# Altium project ws22_companion-1_0_0.PrjPcb (part 4 of 4)

## Sheet switch_profet_btt62001.SchDoc
size A; SheetNumber: 15
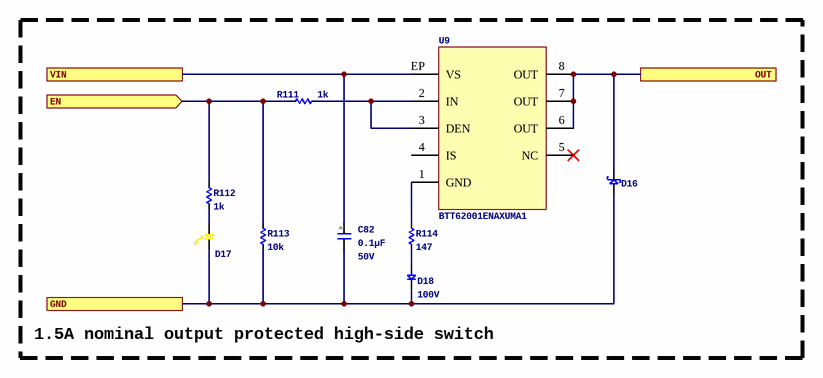
[diagram p17: switch_profet_btt62001.SchDoc]

### Parts
C82  Capacitance: 0.1µF  Voltage - Rated: 50V  [C0402_0.55MM]  (hidden comment: CGA2B3X7R1H104M050BB)
D16  15MQ040NPBF  [SMA]  (value not drawn)
D17  LTST-C190YKT  [LED_0603P_YELLOW]  (value not drawn)
D18  Voltage - DC Reverse (Vr) (Max): 100V  [SOD123]  (hidden comment: 1N4148W-TP)
R111  Resistance: 1k  [R0402_0.40MM]
R112  Resistance: 1k  [R0402_0.40MM]  (hidden comment: ERJ-2RKF1001X)
R113  Resistance: 10k  [R0402_0.40MM]
R114  Resistance: 147  [R0402_0.40MM]  (hidden comment: ERJ-2RKF1470X)
U9  BTT62001ENAXUMA1  [PG-TDSO-8-31]

### Blocks framed on the sheet
1.5A nominal output protected high-side switch: C82 D16-D18 R111-R114 U9

### Ports
EN (in), GND, OUT, VIN

### Nets
GND: C82.2 D16.1 D17.1 D18.2 R113.1 ; port GND
LV: C82.1 U9.EP(VS) ; port VIN
WS22_PWR: D16.2 U9.6(OUT) U9.7(OUT) U9.8(OUT) ; port OUT
WS22_PWREN: R111.2 R112.2 R113.2 ; port EN
NetD17_2: D17.2 R112.1
NetD18_1: D18.1 R114.1
NetR111_1: R111.1 U9.2(IN) U9.3(DEN)
NetR114_2: R114.2 U9.1(GND)

Not connected (* = marked no-connect by the designer): U9 4(IS) 5(NC)*

### Notes on the sheet
- (in symbol CGA2B3X7R1H104M050BB) A

### Library data of the parts
C82 = CGA2B3X7R1H104M050BB: as C48 on sheet eth_lan8742a_phy; ComponentLink1URL: https://product.tdk.com/info/en/catalog/datasheets/mlcc_automotive_general_en.pdf?ref_disty=digikey; ComponentLink1Description: Series Datasheet; Series: CGA; Part Status: Active; Temperature Coefficient: X7R; Operating Temperature: -55°C ~ 125°C; Applications: AEC-Q200; Mounting Type: Surface Mount, MLCC; Package / Case: 0402 (1005 Metric); Size / Dimension: 0.039" L x 0.020" W (1.00mm x 0.50mm); Thickness (Max): 0.022" (0.55mm); Supplier 1: Digikey; Supplier Part Number 1: 445-12271-1-ND; Manufacturer Part Number: CGA2B3X7R1H104M050BB
D16 = SCHOTTKY_15MQ040NPBF: DIODE SCHOTTKY 40V 3A SMA; Manufacturer: Vishay Semiconductor Diodes Division; Supplier 1: Digikey; ComponentLink1URL: https://www.vishay.com/docs/94141/vs-15mq040ntrpbf.pdf; ComponentLink1Description: Datasheet; Supplier Part Number 1: 15MQ040NPBF-ND; Manufacturer Part Number: 15MQ040NPBF
D17 = LED_0603_YELLOW_LTST-C190YKT: LED YELLOW CLEAR 0603 SMD; Manufacturer: Lite-On Inc; Supplier 1: Digikey; ComponentLink1URL: https://mm.digikey.com/Volume0/opasdata/d220001/medias/docus/1176/LTST-C190YKT.pdf; ComponentLink1Description: Datasheet; Supplier Part Number 1: 160-1184-1-ND; Manufacturer Part Number: LTST-C190YKT; Supplier 2: LCSC; Supplier Part Number 2: C125097
D18 = DIODE_1N4148WTPMSTR: DIODE SWITCH 100V 150MA SOD123; Manufacturer: Micro Commercial Co; Diode Type: Standard; Speed: Small Signal =< 200mA (Io), Any Speed; Reverse Recovery Time (trr): 4ns; Current - Reverse Leakage @ Vr: 1µA @ 75V; Capacitance @ Vr, F: 2pF @ 0V, 1MHz; Voltage - Forward (Vf) (Max) @ If: 1.25V @ 150mA; Supplier 1: Digikey; Manufacturer Part Number: 1N4148W-TP; RoHS: RoHS Compliant; Category: Discrete Semiconductor Products; Stock 1: 145222; Pricing 1: 1=0.31, 10=0.202, 25=0.132, 100=0.088, 250=0.0572, 500=0.04048, 1000=0.0286 (USD); Current - Average Rectified (Io): 150mA; Mounting Type: Surface Mount; Package / Case: SOD-123; Supplier Device Package: SOD-123; Packaging: Cut Tape (CT); ComponentLink1URL: http://61.222.192.61/mccsemi/up_pdf/1N4148W(SOD123).pdf; ComponentLink1Description: http://61.222.192.61/mccsemi/up_pdf/1N4148W(SOD123).pdf; Supplier Part Number 1: 1N4148WTPMSCT-ND
R111 = ERJ-2RKF1001X: RES SMD 1K OHM 1% 1/10W 0402; Manufacturer 1: Panasonic Electronic Components; Unit Price (USD): 0.1; Power (Watts): 0.1W, 1/10W; Temperature Coefficient: ±100ppm/°C; ComponentLink1Description: Datasheet; ComponentLink1URL: https://industrial.panasonic.com/cdbs/www-data/pdf/RDA0000/AOA0000C304.pdf; Series: ERJ; Tolerance: ±1%; Composition: Thick Film; Features: Automotive AEC-Q200; Operating Temperature: -55°C ~ 155°C; Package / Case: 0402 (1005 Metric); Supplier Device Package: 0402; Size / Dimension: 0.039" L x 0.020" W (1.00mm x 0.50mm); Height - Seated (Max): 0.016" (0.40mm); Manufacturer Part Number 1: ERJ-2RKF1001X; Supplier 1: Digikey; Supplier Part Number 1: P1.00KLCT-ND
R112 = ERJ-2RKF1001X: as R80 on sheet eth_lan8742a_phy; ComponentLink1Description: Datasheet; ComponentLink1URL: https://industrial.panasonic.com/cdbs/www-data/pdf/RDA0000/AOA0000C304.pdf; Series: ERJ; Tolerance: ±1%; Composition: Thick Film; Features: Automotive AEC-Q200; Operating Temperature: -55°C ~ 155°C; Package / Case: 0402 (1005 Metric); Supplier Device Package: 0402; Size / Dimension: 0.039" L x 0.020" W (1.00mm x 0.50mm); Height - Seated (Max): 0.016" (0.40mm); Supplier 1: Digikey; Supplier Part Number 1: P1.00KLCT-ND; Manufacturer Part Number: ERJ-2RKF1001X
R113 = ERJ-2RKF1002X: RES SMD 10K OHM 1% 1/10W 0402; Manufacturer 1: Panasonic Electronic Components; Unit Price (USD): 0.1; Power (Watts): 0.1W, 1/10W; Temperature Coefficient: ±100ppm/°C; ComponentLink1Description: Datasheet; ComponentLink1URL: https://industrial.panasonic.com/cdbs/www-data/pdf/RDA0000/AOA0000C304.pdf; Series: ERJ; Tolerance: ±1%; Composition: Thick Film; Features: Automotive AEC-Q200; Operating Temperature: -55°C ~ 155°C; Package / Case: 0402 (1005 Metric); Supplier Device Package: 0402; Size / Dimension: 0.039" L x 0.020" W (1.00mm x 0.50mm); Height - Seated (Max): 0.016" (0.40mm); Manufacturer Part Number 1: ERJ-2RKF1002X; Supplier 1: Digikey; Supplier Part Number 1: P10.0KLCT-ND
R114 = ERJ-2RKF1470X: RES SMD 147 OHM 1% 1/10W 0402; Manufacturer: Panasonic Electronic Components; Unit Price (USD): 0.1; Power (Watts): 0.1W, 1/10W; Temperature Coefficient: ±100ppm/°C; ComponentLink1Description: Datasheet; ComponentLink1URL: https://industrial.panasonic.com/cdbs/www-data/pdf/RDA0000/AOA0000C304.pdf; Series: ERJ; Tolerance: ±1%; Composition: Thick Film; Features: Automotive AEC-Q200; Operating Temperature: -55°C ~ 155°C; Package / Case: 0402 (1005 Metric); Supplier Device Package: 0402; Size / Dimension: 0.039" L x 0.020" W (1.00mm x 0.50mm); Height - Seated (Max): 0.016" (0.40mm); Supplier 1: Digikey; Supplier Part Number 1: P147LCT-ND; Manufacturer Part Number: ERJ-2RKF1470X
U9 = PROFET_BTT62001ENAXUMA1: 1.5 amp high side load driver; Manufacturer: Infineon; Supplier 1: Digikey; Supplier Part Number 1: 448-BTT62001ENAXUMA1CT-ND; Manufacturer Part Number: BTT62001ENAXUMA1; ComponentLink1URL: https://www.infineon.com/dgdl/Infineon-BTT6200-1ENA-DS-v01_00-EN.pdf?fileId=5546d462636cc8fb01645f3a31f312e9; ComponentLink1Description: Datasheet; Supplier 2: LCSC; Supplier Part Number 2: C2150255

## Sheet interface_hall.SchDoc
size A; SheetNumber: 16
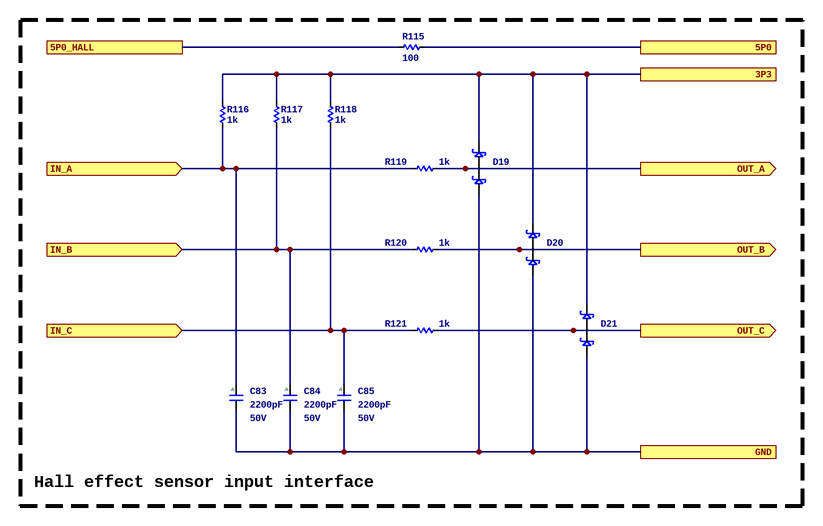
[diagram p18: interface_hall.SchDoc]

### Parts
C83  Capacitance: 2200pF  Voltage - Rated: 50V  [C0402_0.55MM]  (hidden comment: CGA2B2X7R1H222M050BA)
C84  Capacitance: 2200pF  Voltage - Rated: 50V  [C0402_0.55MM]  (hidden comment: CGA2B2X7R1H222M050BA)
C85  Capacitance: 2200pF  Voltage - Rated: 50V  [C0402_0.55MM]  (hidden comment: CGA2B2X7R1H222M050BA)
D19  BAT54SLT1G  [3SOT23]  (value not drawn)
D20  BAT54SLT1G  [3SOT23]  (value not drawn)
D21  BAT54SLT1G  [3SOT23]  (value not drawn)
R115  Resistance: 100  [R1206_0.70MM]  (hidden comment: ERJ-8ENF1000V)
R116  Resistance: 1k  [R0402_0.40MM]
R117  Resistance: 1k  [R0402_0.40MM]
R118  Resistance: 1k  [R0402_0.40MM]
R119  Resistance: 1k  [R0402_0.40MM]
R120  Resistance: 1k  [R0402_0.40MM]
R121  Resistance: 1k  [R0402_0.40MM]

### Blocks framed on the sheet
Hall effect sensor input interface: C83-C85 D19-D21 R115-R121

### Ports
3P3, 5P0, 5P0_HALL, GND, IN_A (in), IN_B (in), IN_C (in), OUT_A (out), OUT_B (out), OUT_C (out)

### Nets
3P3: D19.2 D20.2 D21.2 R116.1 R117.1 R118.1 ; port 3P3
5P0: R115.1 ; port 5P0
GND: C83.2 C84.2 C85.2 D19.1 D20.1 D21.1 ; port GND
CONN_HALL_A: C83.1 R116.2 R119.1 ; port IN_A
CONN_HALL_B: C84.1 R117.2 R120.1 ; port IN_B
CONN_HALL_C: C85.1 R118.2 R121.1 ; port IN_C
CONN_HALL_SUPPLY: R115.2 ; port 5P0_HALL
HALL_A: D19.3 R119.2 ; port OUT_A
HALL_B: D20.3 R120.2 ; port OUT_B
HALL_C: D21.3 R121.2 ; port OUT_C

### Notes on the sheet
- (in symbol CGA2B2X7R1H222M050BA) A

### Library data of the parts
C83-C85 = CGA2B2X7R1H222M050BA: as C58 on sheet eth_100base-tx_magnetics; ComponentLink1URL: https://product.tdk.com/info/en/catalog/datasheets/mlcc_automotive_general_en.pdf?ref_disty=digikey; ComponentLink1Description: Series Datasheet; Series: CGA; Part Status: Active; Temperature Coefficient: X7R; Operating Temperature: -55°C ~ 125°C; Applications: AEC-Q200; Mounting Type: Surface Mount, MLCC; Package / Case: 0402 (1005 Metric); Size / Dimension: 0.039" L x 0.020" W (1.00mm x 0.50mm); Thickness (Max): 0.022" (0.55mm); Supplier 1: Digikey; Supplier Part Number 1: 445-12274-1-ND; Manufacturer Part Number: CGA2B2X7R1H222M050BA
D19-D21 = SCHOTTKY_30V_DUAL_BAT54SLT1G: DIODE SCHOTTKY DUAL 30V SOT23; Manufacturer: ON Semiconductor; Supplier 1: Digikey; Manufacturer Part Number: BAT54SLT1G; RoHS: RoHS Compliant; ComponentLink1URL: https://www.onsemi.com/pdf/datasheet/bat54slt1-d.pdf; ComponentLink1Description: Datasheet; Supplier Part Number 1: BAT54SLT1GOSCT-ND; Supplier 2: LCSC; Supplier Part Number 2: C19726
R115 = ERJ-8ENF1000V: RES SMD 100 OHM 1% 1/4W 1206; Manufacturer: Panasonic Electronic Components; Unit Price (USD): 0.1; Power (Watts): 0.25W, 1/4W; Temperature Coefficient: ±100ppm/°C; ComponentLink1Description: Datasheet; ComponentLink1URL: https://industrial.panasonic.com/cdbs/www-data/pdf/RDA0000/AOA0000C304.pdf; Series: ERJ; Tolerance: ±1%; Composition: Thick Film; Features: Automotive AEC-Q200; Operating Temperature: -55°C ~ 155°C; Package / Case: 1206 (3216 Metric); Supplier Device Package: 1206; Size / Dimension: 0.126" L x 0.063" W (3.20mm x 1.60mm); Height - Seated (Max): 0.028" (0.70mm); Supplier 1: Digikey; Supplier Part Number 1: P100FCT-ND; Manufacturer Part Number: ERJ-8ENF1000V
R116-R121 = ERJ-2RKF1001X: as R111 on sheet switch_profet_btt62001; ComponentLink1Description: Datasheet; ComponentLink1URL: https://industrial.panasonic.com/cdbs/www-data/pdf/RDA0000/AOA0000C304.pdf; Series: ERJ; Tolerance: ±1%; Composition: Thick Film; Features: Automotive AEC-Q200; Operating Temperature: -55°C ~ 155°C; Package / Case: 0402 (1005 Metric); Supplier Device Package: 0402; Size / Dimension: 0.039" L x 0.020" W (1.00mm x 0.50mm); Height - Seated (Max): 0.016" (0.40mm); Manufacturer Part Number 1: ERJ-2RKF1001X; Supplier 1: Digikey; Supplier Part Number 1: P1.00KLCT-ND

## Sheet receiver_am26c32.SchDoc
size A; SheetNumber: 17
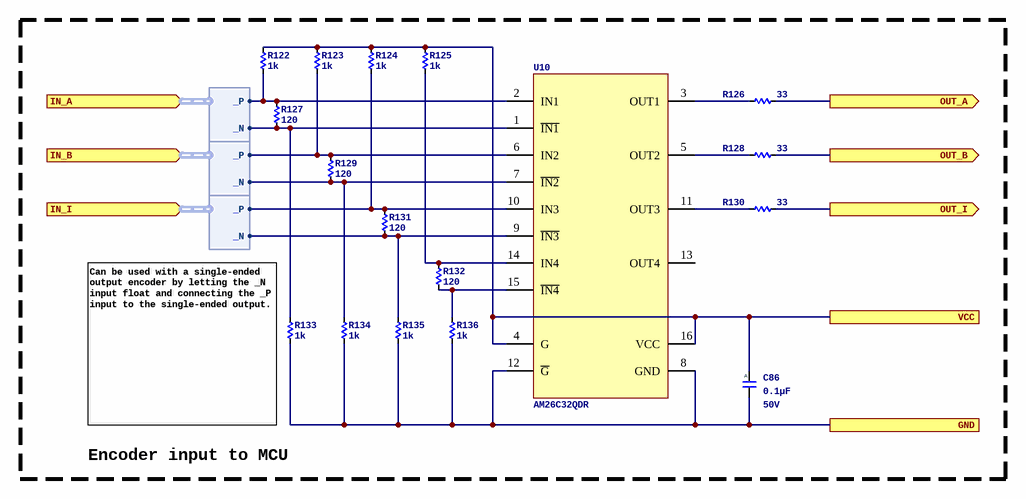
[diagram p19: receiver_am26c32.SchDoc]

### Parts
C86  Capacitance: 0.1µF  Voltage - Rated: 50V  [C0402_0.55MM]  (hidden comment: CGA2B3X7R1H104M050BB)
R122  Resistance: 1k  [R0402_0.40MM]
R123  Resistance: 1k  [R0402_0.40MM]
R124  Resistance: 1k  [R0402_0.40MM]
R125  Resistance: 1k  [R0402_0.40MM]
R126  Resistance: 33  [R0402_0.40MM]  (hidden comment: ERJ-2RKF33R0X)
R127  Resistance: 120  [R0805_0.70MM]  (hidden comment: ERJ-6ENF1200V)
R128  Resistance: 33  [R0402_0.40MM]  (hidden comment: ERJ-2RKF33R0X)
R129  Resistance: 120  [R0805_0.70MM]  (hidden comment: ERJ-6ENF1200V)
R130  Resistance: 33  [R0402_0.40MM]  (hidden comment: ERJ-2RKF33R0X)
R131  Resistance: 120  [R0805_0.70MM]  (hidden comment: ERJ-6ENF1200V)
R132  Resistance: 120  [R0805_0.70MM]  (hidden comment: ERJ-6ENF1200V)
R133  Resistance: 1k  [R0402_0.40MM]
R134  Resistance: 1k  [R0402_0.40MM]
R135  Resistance: 1k  [R0402_0.40MM]
R136  Resistance: 1k  [R0402_0.40MM]
U10  AM26C32QDR  [16SOIC150]

### Blocks framed on the sheet
Encoder input to MCU: C86 R122-R136 U10

### Ports
GND, IN_A (in, harness DIFF), IN_B (in, harness DIFF), IN_I (in, harness DIFF), OUT_A (out), OUT_B (out), OUT_I (out), VCC

### Harnesses
DIFF: _P, _N

### Nets
3P3: C86.1 R122.1 R123.1 R124.1 R125.1 U10.4(G) U10.16(VCC) ; port VCC
GND: C86.2 R133.2 R134.2 R135.2 R136.2 U10.8(GND) U10.12(~{G}) ; port GND
CONN_ENC_A._N: R127.2 R133.1 U10.1(~{IN1}) ; port IN_A._N
CONN_ENC_A._P: R122.2 R127.1 U10.2(IN1) ; port IN_A._P
CONN_ENC_B._N: R129.2 R134.1 U10.7(~{IN2}) ; port IN_B._N
CONN_ENC_B._P: R123.2 R129.1 U10.6(IN2) ; port IN_B._P
CONN_ENC_I._N: R131.2 R135.1 U10.9(~{IN3}) ; port IN_I._N
CONN_ENC_I._P: R124.2 R131.1 U10.10(IN3) ; port IN_I._P
ENC_A: R126.1 ; port OUT_A
ENC_B: R128.1 ; port OUT_B
ENC_I: R130.1 ; port OUT_I
NetR125_2: R125.2 R132.1 U10.14(IN4)
NetR126_2: R126.2 U10.3(OUT1)
NetR128_2: R128.2 U10.5(OUT2)
NetR130_2: R130.2 U10.11(OUT3)
NetR132_2: R132.2 R136.1 U10.15(~{IN4})

Not connected (* = marked no-connect by the designer): U10 13(OUT4)

### Notes on the sheet
- (near R133) Can be used with a single-ended output encoder by letting the _N input float and connecting the _P input to the single-ended output.
- (in symbol CGA2B3X7R1H104M050BB) A

### Library data of the parts
C86 = CGA2B3X7R1H104M050BB: as C48 on sheet eth_lan8742a_phy; ComponentLink1URL: https://product.tdk.com/info/en/catalog/datasheets/mlcc_automotive_general_en.pdf?ref_disty=digikey; ComponentLink1Description: Series Datasheet; Series: CGA; Part Status: Active; Temperature Coefficient: X7R; Operating Temperature: -55°C ~ 125°C; Applications: AEC-Q200; Mounting Type: Surface Mount, MLCC; Package / Case: 0402 (1005 Metric); Size / Dimension: 0.039" L x 0.020" W (1.00mm x 0.50mm); Thickness (Max): 0.022" (0.55mm); Supplier 1: Digikey; Supplier Part Number 1: 445-12271-1-ND; Manufacturer Part Number: CGA2B3X7R1H104M050BB
R122-R125 R133-R136 = ERJ-2RKF1001X: as R111 on sheet switch_profet_btt62001; ComponentLink1Description: Datasheet; ComponentLink1URL: https://industrial.panasonic.com/cdbs/www-data/pdf/RDA0000/AOA0000C304.pdf; Series: ERJ; Tolerance: ±1%; Composition: Thick Film; Features: Automotive AEC-Q200; Operating Temperature: -55°C ~ 155°C; Package / Case: 0402 (1005 Metric); Supplier Device Package: 0402; Size / Dimension: 0.039" L x 0.020" W (1.00mm x 0.50mm); Height - Seated (Max): 0.016" (0.40mm); Manufacturer Part Number 1: ERJ-2RKF1001X; Supplier 1: Digikey; Supplier Part Number 1: P1.00KLCT-ND
R126 R128 R130 = ERJ-2RKF33R0X: as R65 on sheet eth_lan8742a_phy; ComponentLink1Description: Datasheet; ComponentLink1URL: https://industrial.panasonic.com/cdbs/www-data/pdf/RDA0000/AOA0000C304.pdf; Series: ERJ; Tolerance: ±1%; Composition: Thick Film; Features: Automotive AEC-Q200; Operating Temperature: -55°C ~ 155°C; Package / Case: 0402 (1005 Metric); Supplier Device Package: 0402; Size / Dimension: 0.039" L x 0.020" W (1.00mm x 0.50mm); Height - Seated (Max): 0.016" (0.40mm); Supplier 1: Digikey; Supplier Part Number 1: P33.0LCT-ND; Manufacturer Part Number: ERJ-2RKF33R0X
R127 R129 R131 R132 = ERJ-6ENF1200V: RES SMD 120 OHM 1% 1/8W 0805; Manufacturer: Panasonic Electronic Components; Unit Price (USD): 0.1; Power (Watts): 0.125W, 1/8W; Temperature Coefficient: ±100ppm/°C; ComponentLink1Description: Datasheet; ComponentLink1URL: https://industrial.panasonic.com/cdbs/www-data/pdf/RDA0000/AOA0000C304.pdf; Series: ERJ; Tolerance: ±1%; Composition: Thick Film; Features: Automotive AEC-Q200; Operating Temperature: -55°C ~ 155°C; Package / Case: 0805 (2012 Metric); Supplier Device Package: 0805; Size / Dimension: 0.079" L x 0.049" W (2.00mm x 1.25mm); Height - Seated (Max): 0.028" (0.70mm); Supplier 1: Digikey; Supplier Part Number 1: P120CCT-ND; Manufacturer Part Number: ERJ-6ENF1200V
U10 = RS422_AM26C32QDR: Quadruple Differential Line Receiver 16-SOIC -40 to 125; Manufacturer: Texas Instruments; Supplier 1: Digikey; Supplier Part Number 1: 296-47737-1-ND; Manufacturer Part Number: AM26C32QDR; ComponentLink1URL: https://www.ti.com/lit/ds/symlink/am26c32.pdf; ComponentLink1Description: Datasheet; Supplier 2: LCSC; Supplier Part Number 2: C544587

## Sheet interface_temperature.SchDoc
size A; SheetNumber: 20
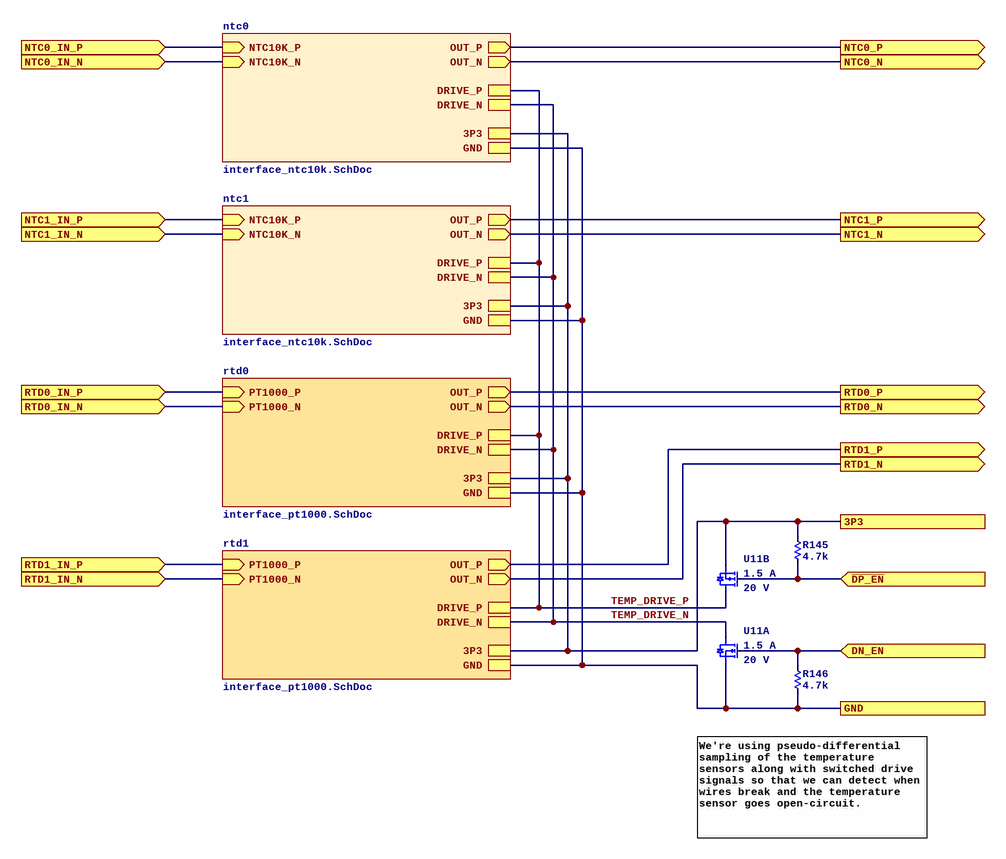
[diagram p20: interface_temperature.SchDoc]

### Parts
R145  Resistance: 4.7k  [R0402_0.40MM]  (hidden comment: ERJ-2RKF4701X)
R146  Resistance: 4.7k  [R0402_0.40MM]  (hidden comment: ERJ-2RKF4701X)
U11  Current: 1.5 A  Voltage: 20 V  [6TSOT23]  (hidden comment: BSL215CH6327XTSA1)  (parts A,B of 2)

### Sub-sheets
ntc0 = interface_ntc10k.SchDoc: 3P3, GND, DRIVE_N, DRIVE_P, OUT_P (out), OUT_N (out), NTC10K_P (in), NTC10K_N (in)
ntc1 = interface_ntc10k.SchDoc: 3P3, GND, DRIVE_N, DRIVE_P, OUT_P (out), OUT_N (out), NTC10K_P (in), NTC10K_N (in)
rtd0 = interface_pt1000.SchDoc: 3P3, GND, PT1000_P (in), PT1000_N (in), DRIVE_N, DRIVE_P, OUT_P (out), OUT_N (out)
rtd1 = interface_pt1000.SchDoc: 3P3, GND, PT1000_P (in), PT1000_N (in), DRIVE_N, DRIVE_P, OUT_P (out), OUT_N (out)

### Ports
3P3, DN_EN (in), GND, NTC0_IN_N (in), NTC0_IN_P (in), NTC0_N (out), NTC0_P (out), NTC1_IN_N (in), NTC1_IN_P (in), NTC1_N (out), NTC1_P (out), RTD0_IN_N (in), RTD0_IN_P (in), RTD0_N (out), RTD0_P (out), RTD1_IN_N (in), RTD1_IN_P (in), RTD1_N (out), RTD1_P (out), ~{DP_EN} (in)

### Nets
3P3: R145.1 U11.2 ; port 3P3, sheet ntc0/3P3, sheet rtd0/3P3, sheet ntc1/3P3, sheet rtd1/3P3
GND: R146.2 U11.5 ; port GND, sheet ntc0/GND, sheet rtd0/GND, sheet ntc1/GND, sheet rtd1/GND
AMBIENT_NTC10K_N: port NTC1_IN_N, sheet ntc1/NTC10K_N
AMBIENT_NTC10K_P: port NTC1_IN_P, sheet ntc1/NTC10K_P
AMBIENT_PT1000_N: port RTD1_IN_N, sheet rtd1/PT1000_N
AMBIENT_PT1000_P: port RTD1_IN_P, sheet rtd1/PT1000_P
DN_EN: R146.1 U11.1 ; port DN_EN
MOTOR_NTC10K_N: port NTC0_IN_N, sheet ntc0/NTC10K_N
MOTOR_NTC10K_P: port NTC0_IN_P, sheet ntc0/NTC10K_P
MOTOR_PT1000_N: port RTD0_IN_N, sheet rtd0/PT1000_N
MOTOR_PT1000_P: port RTD0_IN_P, sheet rtd0/PT1000_P
nDP_EN: R145.2 U11.3 ; port ~{DP_EN}
NTC0_N: port NTC0_N, sheet ntc0/OUT_N
NTC0_P: port NTC0_P, sheet ntc0/OUT_P
NTC1_N: port NTC1_N, sheet ntc1/OUT_N
NTC1_P: port NTC1_P, sheet ntc1/OUT_P
RTD0_N: port RTD0_N, sheet rtd0/OUT_N
RTD0_P: port RTD0_P, sheet rtd0/OUT_P
RTD1_N: port RTD1_N, sheet rtd1/OUT_N
RTD1_P: port RTD1_P, sheet rtd1/OUT_P
TEMP_DRIVE_N: U11.6 ; sheet ntc0/DRIVE_N, sheet rtd0/DRIVE_N, sheet ntc1/DRIVE_N, sheet rtd1/DRIVE_N
TEMP_DRIVE_P: U11.4 ; sheet ntc0/DRIVE_P, sheet rtd0/DRIVE_P, sheet ntc1/DRIVE_P, sheet rtd1/DRIVE_P

### Notes on the sheet
- We're using pseudo-differential sampling of the temperature sensors along with switched drive signals so that we can detect when wires break and the temperature sensor goes open-circuit.

### Library data of the parts
R145 R146 = ERJ-2RKF4701X: RES SMD 4.7K OHM 1% 1/10W 0402; Manufacturer: Panasonic Electronic Components; Unit Price (USD): 0.1; Power (Watts): 0.1W, 1/10W; Temperature Coefficient: ±100ppm/°C; ComponentLink1Description: Datasheet; ComponentLink1URL: https://industrial.panasonic.com/cdbs/www-data/pdf/RDA0000/AOA0000C304.pdf; Series: ERJ; Tolerance: ±1%; Composition: Thick Film; Features: Automotive AEC-Q200; Operating Temperature: -55°C ~ 155°C; Package / Case: 0402 (1005 Metric); Supplier Device Package: 0402; Size / Dimension: 0.039" L x 0.020" W (1.00mm x 0.50mm); Height - Seated (Max): 0.016" (0.40mm); Supplier 1: Digikey; Supplier Part Number 1: P4.70KLCT-ND; Manufacturer Part Number: ERJ-2RKF4701X
U11 = NFET_PFET_20V_BSL215CH6327XTSA1: Dual N/P-Channel 20V 140/150 mOhm 0.73/3nC OptiMOS Small Signal Mosfet - TSOP-6; Manufacturer: Infineon; Supplier 1: Digikey; Supplier Part Number 1: BSL215CH6327XTSA1CT-ND; Manufacturer Part Number: BSL215CH6327XTSA1; Supplier 2: LCSC; Supplier Part Number 2: C3279333

## Sheet interface_ntc10k.SchDoc
size A; SheetNumber: 19
Used 2 times, as channels temperatures0/ntc0, temperatures0/ntc1. Parts and nets are listed once, with the designators drawn on the sheet.
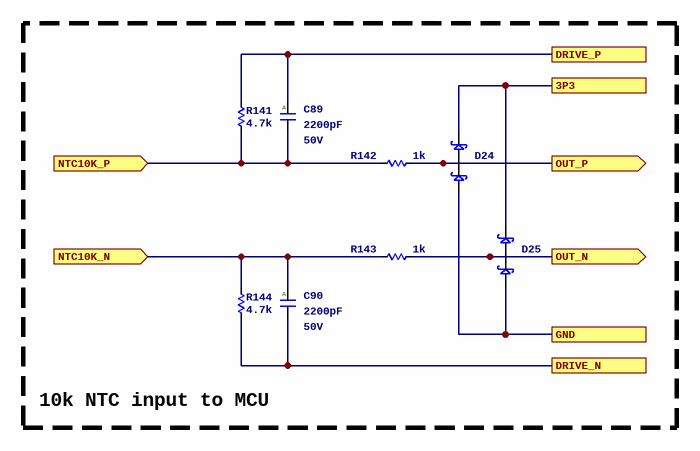
[diagram p21: interface_ntc10k.SchDoc]

### Parts
C89  Capacitance: 2200pF  Voltage - Rated: 50V  [C0402_0.55MM]  (hidden comment: CGA2B2X7R1H222M050BA)
C90  Capacitance: 2200pF  Voltage - Rated: 50V  [C0402_0.55MM]  (hidden comment: CGA2B2X7R1H222M050BA)
D24  BAT54SLT1G  [3SOT23]  (value not drawn)
D25  BAT54SLT1G  [3SOT23]  (value not drawn)
R141  Resistance: 4.7k  [R0402_0.40MM]  (hidden comment: ERJ-2RKF4701X)
R142  Resistance: 1k  [R0402_0.40MM]
R143  Resistance: 1k  [R0402_0.40MM]
R144  Resistance: 4.7k  [R0402_0.40MM]  (hidden comment: ERJ-2RKF4701X)

### Blocks framed on the sheet
10k NTC input to MCU: C89 C90 D24 D25 R141-R144

### Ports
3P3, DRIVE_N, DRIVE_P, GND, NTC10K_N (in), NTC10K_P (in), OUT_N (out), OUT_P (out)

### Nets
3P3: D24.2 D25.2 ; port 3P3
DRIVE_N: C90.2 R144.2 ; port DRIVE_N
DRIVE_P: C89.1 R141.1 ; port DRIVE_P
GND: D24.1 D25.1 ; port GND
NTC10K_N: C90.1 R143.1 R144.1 ; port NTC10K_N
NTC10K_P: C89.2 R141.2 R142.1 ; port NTC10K_P
OUT_N: D25.3 R143.2 ; port OUT_N
OUT_P: D24.3 R142.2 ; port OUT_P

### Channels
temperatures0/ntc0: designators end in A; ports 3P3=3P3 DRIVE_N=TEMP_DRIVE_N DRIVE_P=TEMP_DRIVE_P GND=GND NTC10K_N=MOTOR_NTC10K_N NTC10K_P=MOTOR_NTC10K_P OUT_N=NTC0_N OUT_P=NTC0_P
temperatures0/ntc1: designators end in B; ports 3P3=3P3 DRIVE_N=TEMP_DRIVE_N DRIVE_P=TEMP_DRIVE_P GND=GND NTC10K_N=AMBIENT_NTC10K_N NTC10K_P=AMBIENT_NTC10K_P OUT_N=NTC1_N OUT_P=NTC1_P

### Notes on the sheet
- (in symbol CGA2B2X7R1H222M050BA) A

### Library data of the parts
C89 C90 = CGA2B2X7R1H222M050BA: as C58 on sheet eth_100base-tx_magnetics; ComponentLink1URL: https://product.tdk.com/info/en/catalog/datasheets/mlcc_automotive_general_en.pdf?ref_disty=digikey; ComponentLink1Description: Series Datasheet; Series: CGA; Part Status: Active; Temperature Coefficient: X7R; Operating Temperature: -55°C ~ 125°C; Applications: AEC-Q200; Mounting Type: Surface Mount, MLCC; Package / Case: 0402 (1005 Metric); Size / Dimension: 0.039" L x 0.020" W (1.00mm x 0.50mm); Thickness (Max): 0.022" (0.55mm); Supplier 1: Digikey; Supplier Part Number 1: 445-12274-1-ND; Manufacturer Part Number: CGA2B2X7R1H222M050BA
D24 D25 = SCHOTTKY_30V_DUAL_BAT54SLT1G: as D19-D21 on sheet interface_hall; Supplier 1: Digikey; Manufacturer Part Number: BAT54SLT1G; RoHS: RoHS Compliant; ComponentLink1URL: https://www.onsemi.com/pdf/datasheet/bat54slt1-d.pdf; ComponentLink1Description: Datasheet; Supplier Part Number 1: BAT54SLT1GOSCT-ND; Supplier 2: LCSC; Supplier Part Number 2: C19726
R141 R144 = ERJ-2RKF4701X: as R145 on sheet interface_temperature; ComponentLink1Description: Datasheet; ComponentLink1URL: https://industrial.panasonic.com/cdbs/www-data/pdf/RDA0000/AOA0000C304.pdf; Series: ERJ; Tolerance: ±1%; Composition: Thick Film; Features: Automotive AEC-Q200; Operating Temperature: -55°C ~ 155°C; Package / Case: 0402 (1005 Metric); Supplier Device Package: 0402; Size / Dimension: 0.039" L x 0.020" W (1.00mm x 0.50mm); Height - Seated (Max): 0.016" (0.40mm); Supplier 1: Digikey; Supplier Part Number 1: P4.70KLCT-ND; Manufacturer Part Number: ERJ-2RKF4701X
R142 R143 = ERJ-2RKF1001X: as R111 on sheet switch_profet_btt62001; ComponentLink1Description: Datasheet; ComponentLink1URL: https://industrial.panasonic.com/cdbs/www-data/pdf/RDA0000/AOA0000C304.pdf; Series: ERJ; Tolerance: ±1%; Composition: Thick Film; Features: Automotive AEC-Q200; Operating Temperature: -55°C ~ 155°C; Package / Case: 0402 (1005 Metric); Supplier Device Package: 0402; Size / Dimension: 0.039" L x 0.020" W (1.00mm x 0.50mm); Height - Seated (Max): 0.016" (0.40mm); Manufacturer Part Number 1: ERJ-2RKF1001X; Supplier 1: Digikey; Supplier Part Number 1: P1.00KLCT-ND

## Sheet interface_pt1000.SchDoc
size A; SheetNumber: 18
Used 2 times, as channels temperatures0/rtd0, temperatures0/rtd1. Parts and nets are listed once, with the designators drawn on the sheet.
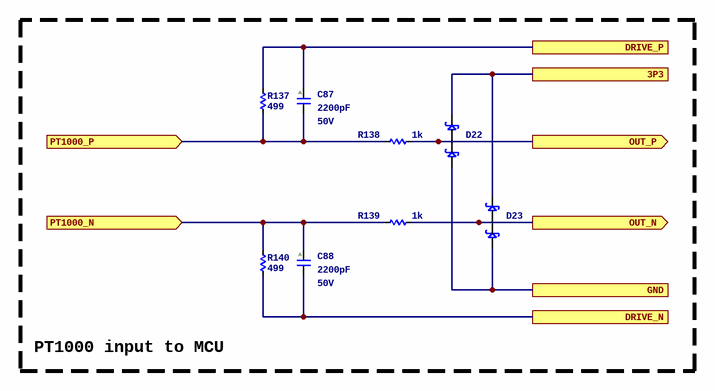
[diagram p22: interface_pt1000.SchDoc]

### Parts
C87  Capacitance: 2200pF  Voltage - Rated: 50V  [C0402_0.55MM]  (hidden comment: CGA2B2X7R1H222M050BA)
C88  Capacitance: 2200pF  Voltage - Rated: 50V  [C0402_0.55MM]  (hidden comment: CGA2B2X7R1H222M050BA)
D22  BAT54SLT1G  [3SOT23]  (value not drawn)
D23  BAT54SLT1G  [3SOT23]  (value not drawn)
R137  Resistance: 499  [R0402_0.40MM]  (hidden comment: ERJ-2RKF4990X)
R138  Resistance: 1k  [R0402_0.40MM]
R139  Resistance: 1k  [R0402_0.40MM]
R140  Resistance: 499  [R0402_0.40MM]  (hidden comment: ERJ-2RKF4990X)

### Blocks framed on the sheet
PT1000 input to MCU: C87 C88 D22 D23 R137-R140

### Ports
3P3, DRIVE_N, DRIVE_P, GND, OUT_N (out), OUT_P (out), PT1000_N (in), PT1000_P (in)

### Nets
3P3: D22.2 D23.2 ; port 3P3
DRIVE_N: C88.2 R140.2 ; port DRIVE_N
DRIVE_P: C87.1 R137.1 ; port DRIVE_P
GND: D22.1 D23.1 ; port GND
OUT_N: D23.3 R139.2 ; port OUT_N
OUT_P: D22.3 R138.2 ; port OUT_P
PT1000_N: C88.1 R139.1 R140.1 ; port PT1000_N
PT1000_P: C87.2 R137.2 R138.1 ; port PT1000_P

### Channels
temperatures0/rtd0: designators end in A; ports 3P3=3P3 DRIVE_N=TEMP_DRIVE_N DRIVE_P=TEMP_DRIVE_P GND=GND OUT_N=RTD0_N OUT_P=RTD0_P PT1000_N=MOTOR_PT1000_N PT1000_P=MOTOR_PT1000_P
temperatures0/rtd1: designators end in B; ports 3P3=3P3 DRIVE_N=TEMP_DRIVE_N DRIVE_P=TEMP_DRIVE_P GND=GND OUT_N=RTD1_N OUT_P=RTD1_P PT1000_N=AMBIENT_PT1000_N PT1000_P=AMBIENT_PT1000_P

### Notes on the sheet
- (in symbol CGA2B2X7R1H222M050BA) A

### Library data of the parts
C87 C88 = CGA2B2X7R1H222M050BA: as C58 on sheet eth_100base-tx_magnetics; ComponentLink1URL: https://product.tdk.com/info/en/catalog/datasheets/mlcc_automotive_general_en.pdf?ref_disty=digikey; ComponentLink1Description: Series Datasheet; Series: CGA; Part Status: Active; Temperature Coefficient: X7R; Operating Temperature: -55°C ~ 125°C; Applications: AEC-Q200; Mounting Type: Surface Mount, MLCC; Package / Case: 0402 (1005 Metric); Size / Dimension: 0.039" L x 0.020" W (1.00mm x 0.50mm); Thickness (Max): 0.022" (0.55mm); Supplier 1: Digikey; Supplier Part Number 1: 445-12274-1-ND; Manufacturer Part Number: CGA2B2X7R1H222M050BA
D22 D23 = SCHOTTKY_30V_DUAL_BAT54SLT1G: as D19-D21 on sheet interface_hall; Supplier 1: Digikey; Manufacturer Part Number: BAT54SLT1G; RoHS: RoHS Compliant; ComponentLink1URL: https://www.onsemi.com/pdf/datasheet/bat54slt1-d.pdf; ComponentLink1Description: Datasheet; Supplier Part Number 1: BAT54SLT1GOSCT-ND; Supplier 2: LCSC; Supplier Part Number 2: C19726
R137 R140 = ERJ-2RKF4990X: RES SMD 499 OHM 1% 1/10W 0402; Manufacturer: Panasonic Electronic Components; Unit Price (USD): 0.1; Power (Watts): 0.1W, 1/10W; Temperature Coefficient: ±100ppm/°C; ComponentLink1Description: Datasheet; ComponentLink1URL: https://industrial.panasonic.com/cdbs/www-data/pdf/RDA0000/AOA0000C304.pdf; Series: ERJ; Tolerance: ±1%; Composition: Thick Film; Features: Automotive AEC-Q200; Operating Temperature: -55°C ~ 155°C; Package / Case: 0402 (1005 Metric); Supplier Device Package: 0402; Size / Dimension: 0.039" L x 0.020" W (1.00mm x 0.50mm); Height - Seated (Max): 0.016" (0.40mm); Supplier 1: Digikey; Supplier Part Number 1: P499LCT-ND; Manufacturer Part Number: ERJ-2RKF4990X
R138 R139 = ERJ-2RKF1001X: as R111 on sheet switch_profet_btt62001; ComponentLink1Description: Datasheet; ComponentLink1URL: https://industrial.panasonic.com/cdbs/www-data/pdf/RDA0000/AOA0000C304.pdf; Series: ERJ; Tolerance: ±1%; Composition: Thick Film; Features: Automotive AEC-Q200; Operating Temperature: -55°C ~ 155°C; Package / Case: 0402 (1005 Metric); Supplier Device Package: 0402; Size / Dimension: 0.039" L x 0.020" W (1.00mm x 0.50mm); Height - Seated (Max): 0.016" (0.40mm); Manufacturer Part Number 1: ERJ-2RKF1001X; Supplier 1: Digikey; Supplier Part Number 1: P1.00KLCT-ND

## Nets that join several sheets
1P2: top (TP44.1), pmic_tps65263_buck (C45.1 L3.2 R62.2), eth_lan8742a_phy (C52.1 U3.6)
3P3: top (TP43.1), mcu_stm32f427 (19 pins), pmic_tps65263_buck (C42.1 L2.2 R58.2 U2.5), fan_interface (D10.2 D11.2 R85.1 R86.1), can_tcan1462v (C65.1 U4.5), eth_lan8742a_phy (C51.1 FB3.1 R67.1 U3.9), driver_am26c31_isolated (C79.1 R107.1 U7.1), resolver_ad2s1210 (C69.1 U5.18), interface_hall (6 pins), receiver_am26c32 (7 pins), interface_temperature (R145.1 U11.2), temperatures0/ntc0 (D24A.2 D25A.2), temperatures0/rtd0 (D22A.2 D23A.2), temperatures0/ntc1 (D24B.2 D25B.2), temperatures0/rtd1 (D22B.2 D23B.2)
5P0: top (TP42.1), conn_usbc (C63.1 J8.A4 J8.B4), pmic_tps65263_buck (8 pins), can_tcan1462v (C64.1 U4.3), conn_motor (J11.12), resolver_ad2s1210 (C67.1 C70.1 FB5.2 U5.6), interface_hall (R115.1)
5P0_B: top (TP38.1), conn_ffc_ws22_12pin (J9.12), driver_am26c31_isolated (6 pins)
12P0_B: top (TP37.1), conn_ffc_ws22_12pin (J9.10)
CHASSIS: top (17 pins), eth_100base-tx_magnetics (C58.2)
GND: top (8 pins), mcu_stm32f427 (35 pins), conn_usbc (7 pins), pmic_tps65263_buck (25 pins), fan_interface (C61.2 C62.2 D10.1 D11.1), can_tcan1462v (6 pins), eth_lan8742a_phy (12 pins), eth_100base-tx_magnetics (C56.2 C59.2), conn_ffc_ws22_8pin (J10.1 J10.2 J10.3), conn_lv (D15.1 J12.4 J12.8), conn_motor (J11.11 J11.25 J11.29 J11.33), driver_am26c31_isolated (6 pins), resolver_ad2s1210 (17 pins), switch_profet_btt62001 (5 pins), interface_hall (6 pins), receiver_am26c32 (7 pins), interface_temperature (R146.2 U11.5), temperatures0/ntc0 (D24A.1 D25A.1), temperatures0/rtd0 (D22A.1 D23A.1), temperatures0/ntc1 (D24B.1 D25B.1), temperatures0/rtd1 (D22B.1 D23B.1)
GND_B: top (TP45.1), conn_ffc_ws22_12pin (J9.9 J9.11), driver_am26c31_isolated (6 pins)
LV: top (C30.1), pmic_tps65263_buck (FB2.1), fan_interface (FB4.1), conn_lv (D14.2), resolver_ad2s1210 (FB6.1), switch_profet_btt62001 (C82.1 U9.EP)
LV_INPUT: top (TP41.1), conn_lv (5 pins)
100B-PHY.RX_N: eth_lan8742a_phy (R74.2 U3.22), eth_100base-tx_magnetics (T1.3)
100B-PHY.RX_P: eth_lan8742a_phy (R72.2 U3.23), eth_100base-tx_magnetics (T1.1)
100B-PHY.TX_N: eth_lan8742a_phy (R73.2 U3.20), eth_100base-tx_magnetics (T1.8)
100B-PHY.TX_P: eth_lan8742a_phy (R71.2 U3.21), eth_100base-tx_magnetics (T1.6)
AMBIENT_NTC10K_N: conn_lv (J12.15), temperatures0/ntc1 (C90B.1 R143B.1 R144B.1)
AMBIENT_NTC10K_P: conn_lv (J12.14), temperatures0/ntc1 (C89B.2 R141B.2 R142B.1)
AMBIENT_PT1000_N: conn_lv (J12.9), temperatures0/rtd1 (C88B.1 R139B.1 R140B.1)
AMBIENT_PT1000_P: conn_lv (J12.10), temperatures0/rtd1 (C87B.2 R137B.2 R138B.1)
CAN1_MDI._N: can_tcan1462v (T2.4), conn_ffc_ws22_8pin (J10.4), conn_lv (J12.3 J12.7)
CAN1_MDI._P: can_tcan1462v (T2.3), conn_ffc_ws22_8pin (J10.5), conn_lv (J12.2 J12.6)
CAN2.RX: mcu_stm32f427 (U1.91), can_tcan1462v (TP3.1 U4.4)
CAN2.TX: mcu_stm32f427 (R1.1), can_tcan1462v (R94.1 TP4.1)
CONN_ENC_A._N: conn_motor (J11.4), receiver_am26c32 (R127.2 R133.1 U10.1)
CONN_ENC_A._P: conn_motor (J11.3), receiver_am26c32 (R122.2 R127.1 U10.2)
CONN_ENC_B._N: conn_motor (J11.7), receiver_am26c32 (R129.2 R134.1 U10.7)
CONN_ENC_B._P: conn_motor (J11.6), receiver_am26c32 (R123.2 R129.1 U10.6)
CONN_ENC_I._N: conn_motor (J11.10), receiver_am26c32 (R131.2 R135.1 U10.9)
CONN_ENC_I._P: conn_motor (J11.9), receiver_am26c32 (R124.2 R131.1 U10.10)
CONN_HALL_A: conn_motor (J11.26), interface_hall (C83.1 R116.2 R119.1)
CONN_HALL_B: conn_motor (J11.30), interface_hall (C84.1 R117.2 R120.1)
CONN_HALL_C: conn_motor (J11.34), interface_hall (C85.1 R118.2 R121.1)
CONN_HALL_SUPPLY: conn_motor (J11.27 J11.31 J11.35), interface_hall (R115.2)
CONN_RES_COS._N: conn_motor (J11.20), resolver_ad2s1210 (U5.44)
CONN_RES_COS._P: conn_motor (J11.19), resolver_ad2s1210 (U5.45)
CONN_RES_EXC._N: conn_motor (J11.17), resolver_ad2s1210 (R99.1 TP23.1 U6.1)
CONN_RES_EXC._P: conn_motor (J11.16), resolver_ad2s1210 (R104.1 TP24.1 U6.7)
CONN_RES_REFOUT: top (R46.1), resolver_ad2s1210 (U5.47)
CONN_RES_SIN._N: conn_motor (J11.23), resolver_ad2s1210 (U5.42)
CONN_RES_SIN._P: conn_motor (J11.22), resolver_ad2s1210 (U5.41)
DN_EN: mcu_stm32f427 (R27.1), interface_temperature (R146.1 U11.1)
ENC_A: top (TP8.1), mcu_stm32f427 (U1.77), receiver_am26c32 (R126.1)
ENC_B: top (TP10.1), mcu_stm32f427 (U1.89), receiver_am26c32 (R128.1)
ENC_I: top (TP12.1), mcu_stm32f427 (U1.47), receiver_am26c32 (R130.1)
ENC_SHIELD: top (R42.2 R43.2), conn_motor (J11.5 J11.8)
ETH_MDI.RX_N: eth_100base-tx_magnetics (T1.14), conn_lv (J12.21)
ETH_MDI.RX_P: eth_100base-tx_magnetics (T1.16), conn_lv (J12.20)
ETH_MDI.TX_N: eth_100base-tx_magnetics (T1.9), conn_lv (J12.23)
ETH_MDI.TX_P: eth_100base-tx_magnetics (T1.11), conn_lv (J12.22)
ETH_PHY_nRST: mcu_stm32f427 (R17.1), eth_lan8742a_phy (C53.1 R67.2 U3.15)
ETH_RMII.CRS_DV: mcu_stm32f427 (U1.32), eth_lan8742a_phy (R75.2)
ETH_RMII.RXD0: mcu_stm32f427 (U1.33), eth_lan8742a_phy (R76.2)
ETH_RMII.RXD1: mcu_stm32f427 (U1.34), eth_lan8742a_phy (R77.2)
ETH_RMII.TX_EN: mcu_stm32f427 (R30.1), eth_lan8742a_phy (U3.16)
ETH_RMII.TXD0: mcu_stm32f427 (R33.1), eth_lan8742a_phy (U3.17)
ETH_RMII.TXD1: mcu_stm32f427 (R35.1), eth_lan8742a_phy (U3.18)
ETH_RMII_REFCLK: mcu_stm32f427 (U1.24), eth_lan8742a_phy (R66.2)
ETH_SMI.MDC: mcu_stm32f427 (U1.16), eth_lan8742a_phy (U3.13)
ETH_SMI.MDIO: mcu_stm32f427 (R40.1 U1.25), eth_lan8742a_phy (R65.2)
FAN0_POWER: fan_interface (C61.1 FB4.2 R89.2), conn_lv (J12.18)
FAN0_PWM: fan_interface (R87.1), conn_lv (J12.17)
FAN0_TACH: fan_interface (R86.2 R88.1), conn_lv (J12.16)
HALL_A: top (TP15.1), mcu_stm32f427 (U1.63), interface_hall (D19.3 R119.2)
HALL_B: top (TP16.1), mcu_stm32f427 (U1.64), interface_hall (D20.3 R120.2)
HALL_C: top (TP17.1), mcu_stm32f427 (U1.65), interface_hall (D21.3 R121.2)
HALL_SHIELD: top (R44.2 R45.2), conn_motor (J11.24 J11.28 J11.32)
MCU_A: top (TP9.1), mcu_stm32f427 (R29.1), driver_am26c31_isolated (R109.2 U7.4)
MCU_B: top (TP11.1), mcu_stm32f427 (R6.1), driver_am26c31_isolated (R108.2 U7.5)
MCU_FAN0_PWM: top (TP32.1), mcu_stm32f427 (R21.1), fan_interface (D10.3 R85.2 R87.2)
MCU_FAN0_TACH: top (TP33.1), mcu_stm32f427 (U1.5), fan_interface (D11.3 R88.2)
MCU_I: top (TP13.1), mcu_stm32f427 (R8.1), driver_am26c31_isolated (R110.2 U7.6)
MCU_UART_TX: top (TP14.1), mcu_stm32f427 (R41.1), driver_am26c31_isolated (R107.2 U7.3)
MOTOR_NTC10K_N: conn_motor (J11.2), temperatures0/ntc0 (C90A.1 R143A.1 R144A.1)
MOTOR_NTC10K_P: conn_motor (J11.1), temperatures0/ntc0 (C89A.2 R141A.2 R142A.1)
MOTOR_PT1000_N: conn_motor (J11.14), temperatures0/rtd0 (C88A.1 R139A.1 R140A.1)
MOTOR_PT1000_P: conn_motor (J11.13), temperatures0/rtd0 (C87A.2 R137A.2 R138A.1)
nDP_EN: mcu_stm32f427 (R25.1), interface_temperature (R145.2 U11.3)
NetC48_1: eth_lan8742a_phy (12 pins), eth_100base-tx_magnetics (C56.1 C59.1 T1.2 T1.7)
NTC0_N: mcu_stm32f427 (U1.17), temperatures0/ntc0 (D25A.3 R143A.2)
NTC0_P: mcu_stm32f427 (U1.15), temperatures0/ntc0 (D24A.3 R142A.2)
NTC1_N: mcu_stm32f427 (U1.23), temperatures0/ntc1 (D25B.3 R143B.2)
NTC1_P: mcu_stm32f427 (U1.18), temperatures0/ntc1 (D24B.3 R142B.2)
RES_A: mcu_stm32f427 (U1.59), resolver_ad2s1210 (TP18.1 U5.29)
RES_A0: mcu_stm32f427 (R26.1), resolver_ad2s1210 (U5.37)
RES_A1: mcu_stm32f427 (R28.1), resolver_ad2s1210 (U5.36)
RES_B: mcu_stm32f427 (U1.60), resolver_ad2s1210 (TP19.1 U5.30)
RES_DIR: mcu_stm32f427 (U1.62), resolver_ad2s1210 (TP21.1 U5.32)
RES_I: mcu_stm32f427 (U1.61), resolver_ad2s1210 (TP20.1 U5.31)
RES_nCS: mcu_stm32f427 (R31.1), resolver_ad2s1210 (TP22.1 U5.2)
RES_nRD: mcu_stm32f427 (R18.1), resolver_ad2s1210 (U5.3)
RES_nRST: mcu_stm32f427 (R11.1), resolver_ad2s1210 (U5.33)
RES_nSAMPLE: mcu_stm32f427 (R20.1), resolver_ad2s1210 (U5.10)
RES_nSOE: mcu_stm32f427 (R24.1), resolver_ad2s1210 (U5.9)
RES_nWR: mcu_stm32f427 (R23.1), resolver_ad2s1210 (U5.4)
RES_RES0: mcu_stm32f427 (R37.1), resolver_ad2s1210 (U5.48)
RES_RES1: mcu_stm32f427 (R39.1), resolver_ad2s1210 (U5.1)
RES_SHIELD: top (R46.2 R47.2 R48.2), conn_motor (J11.15 J11.18 J11.21)
RTD0_N: mcu_stm32f427 (U1.31), temperatures0/rtd0 (D23A.3 R139A.2)
RTD0_P: mcu_stm32f427 (U1.26), temperatures0/rtd0 (D22A.3 R138A.2)
RTD1_N: mcu_stm32f427 (U1.36), temperatures0/rtd1 (D23B.3 R139B.2)
RTD1_P: mcu_stm32f427 (U1.35), temperatures0/rtd1 (D22B.3 R138B.2)
SPI4.MISO: mcu_stm32f427 (U1.44), resolver_ad2s1210 (R97.1 TP5.1)
SPI4.MOSI: mcu_stm32f427 (R38.1), resolver_ad2s1210 (TP6.1 U5.12)
SPI4.SCK: mcu_stm32f427 (R34.1), resolver_ad2s1210 (TP7.1 U5.13)
TEMP_DRIVE_N: interface_temperature (U11.6), temperatures0/ntc0 (C90A.2 R144A.2), temperatures0/rtd0 (C88A.2 R140A.2), temperatures0/ntc1 (C90B.2 R144B.2), temperatures0/rtd1 (C88B.2 R140B.2)
TEMP_DRIVE_P: interface_temperature (U11.4), temperatures0/ntc0 (C89A.1 R141A.1), temperatures0/rtd0 (C87A.1 R137A.1), temperatures0/ntc1 (C89B.1 R141B.1), temperatures0/rtd1 (C87B.1 R137B.1)
USB._N: mcu_stm32f427 (U1.70), conn_usbc (D12.2 R93.1)
USB._P: mcu_stm32f427 (U1.71), conn_usbc (D12.1 R92.1)
WS22_A._N: conn_ffc_ws22_12pin (J9.7), driver_am26c31_isolated (U8.5)
WS22_A._P: conn_ffc_ws22_12pin (J9.8), driver_am26c31_isolated (U8.6)
WS22_B._N: conn_ffc_ws22_12pin (J9.5), driver_am26c31_isolated (U8.11)
WS22_B._P: conn_ffc_ws22_12pin (J9.6), driver_am26c31_isolated (U8.10)
WS22_I._N: conn_ffc_ws22_12pin (J9.3), driver_am26c31_isolated (U8.13)
WS22_I._P: conn_ffc_ws22_12pin (J9.4), driver_am26c31_isolated (U8.14)
WS22_PWR: conn_ffc_ws22_8pin (J10.6 J10.7 J10.8), switch_profet_btt62001 (D16.2 U9.6 U9.7 U9.8)
WS22_PWREN: mcu_stm32f427 (R13.1), switch_profet_btt62001 (R111.2 R112.2 R113.2)
WS22_UART._N: conn_ffc_ws22_12pin (J9.1), driver_am26c31_isolated (U8.3)
WS22_UART._P: conn_ffc_ws22_12pin (J9.2), driver_am26c31_isolated (U8.2)

## Assembly variants
0: not fitted R43 R45 R47 R48